# EAGLE board CFT-PB1-revC-TSSOP (EAGLE 5.11), part 1 of 2
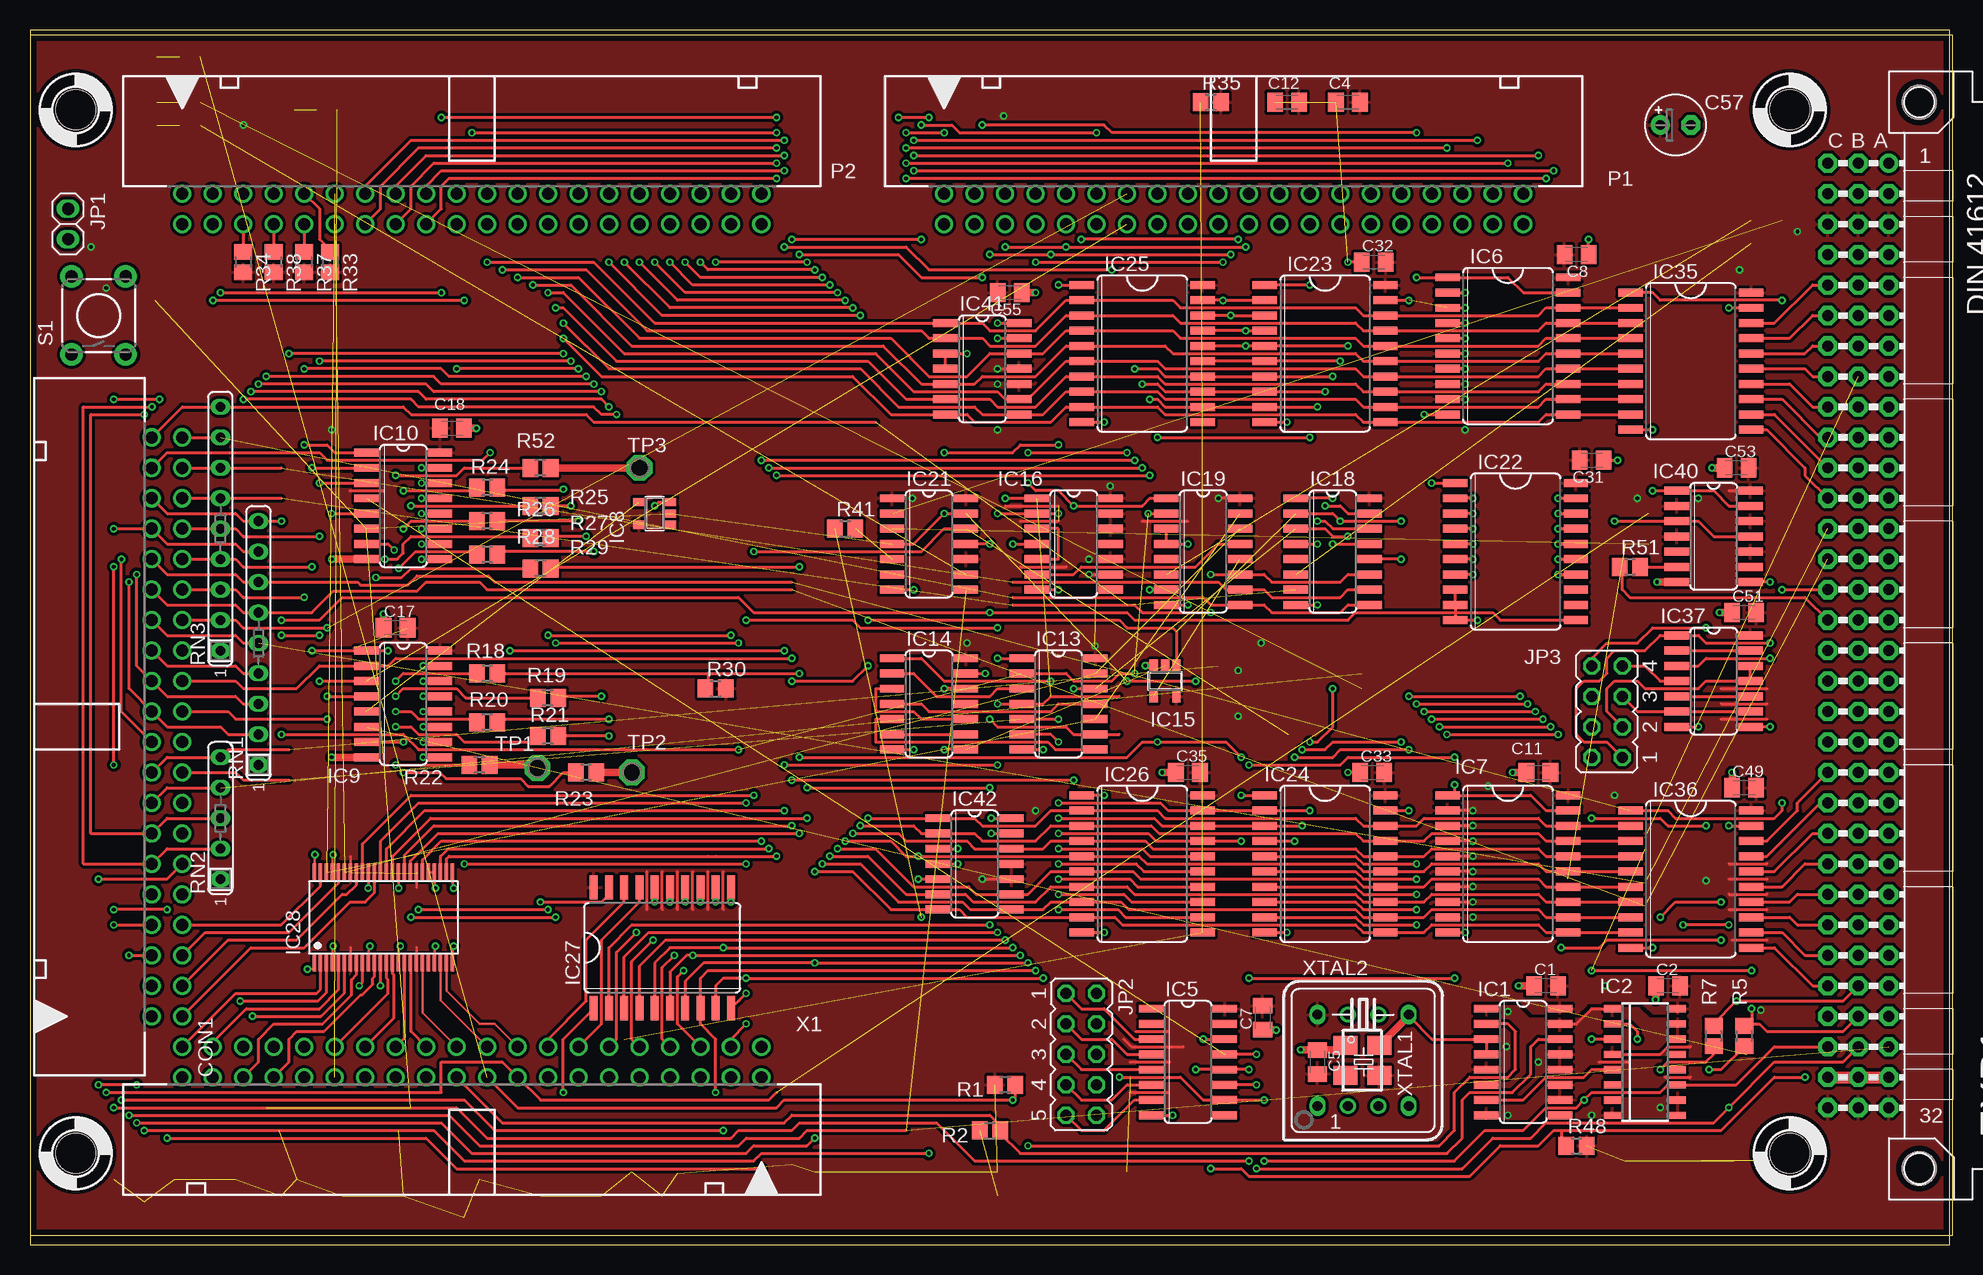
[diagram p11: board, top side]
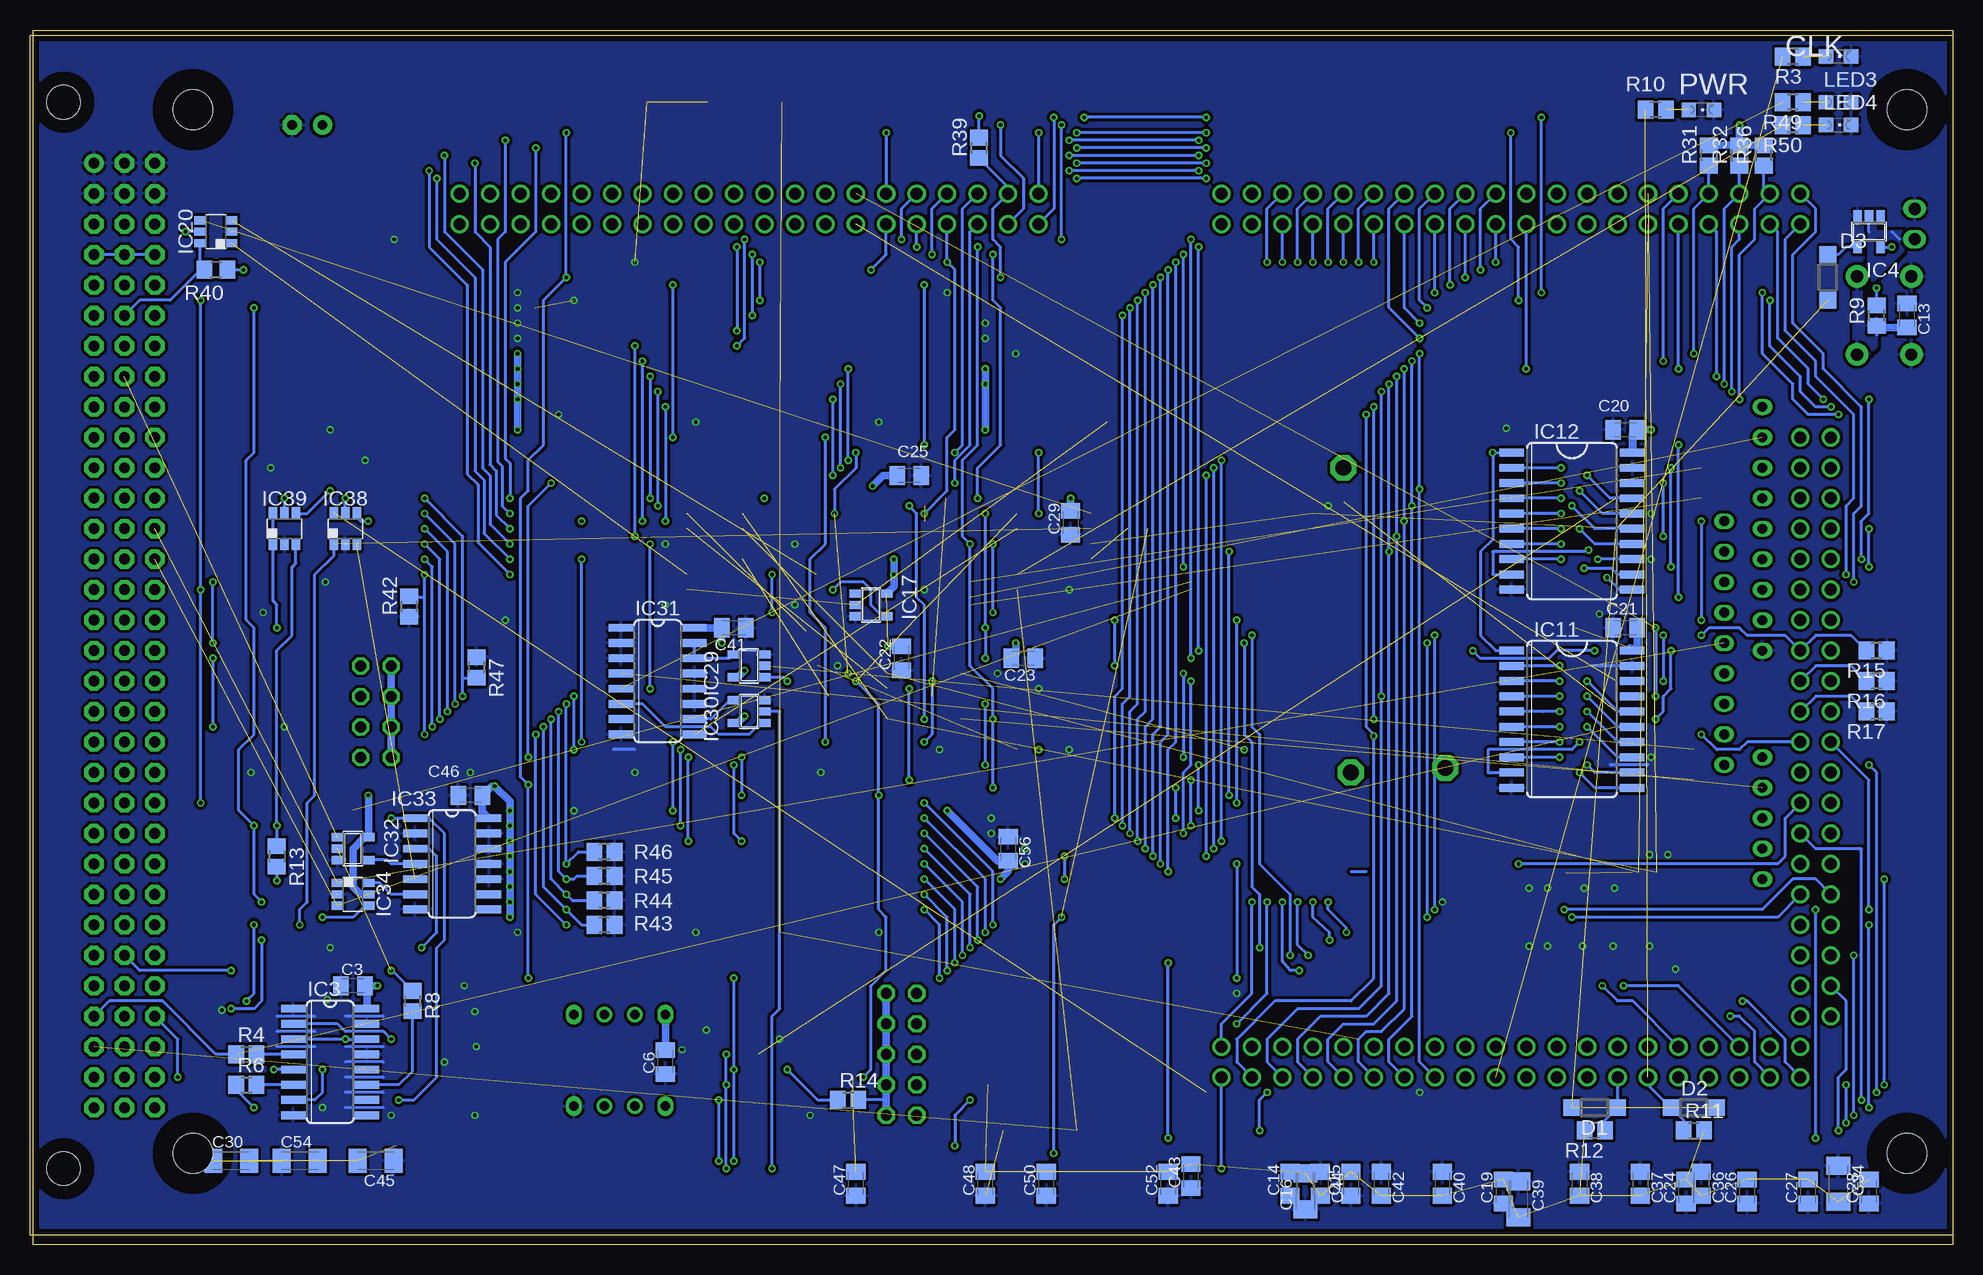
[diagram p12: board, bottom side, seen from below]

Size 160 x 101.27 mm. Coordinates in mm from the lower left corner, seen from the top.
Outline: 0,0 160,0 160,101.27 0,101.27 0,0
Copper layers (1*16): Top 0.035mm / dielectric 1.5mm / Bottom 0.035mm
Design rules "smart-prototyping *": minimum track width 7mil, minimum drill 12mil, track to track 7mil, track to pad 7mil, pad to pad 7mil, via to via 7mil, smd to smd 0mil, copper to edge 20mil, drill to drill 10mil, minimum pad ring 10mil, minimum via ring 6mil, stop-mask expansion 2mil, vias tented up to drill 25mil, thermal gap 10mil
Net classes: 0 default: width 0.152 mm, clearance 0.152 mm; 1 low power: width 0.305 mm, clearance 0.152 mm; 2 LED power: width 0.406 mm, clearance 0.254 mm

## Footprints (pad centres in the part's own frame; a part is rotated, then mirrored left to right if it is on the bottom)
C0805K = smd 1.3 x 1.6: 1 -1,0; 2 1,0
C1206K = smd 1.5 x 2: 1 -1.5,0; 2 1.5,0
E2,5-5 = drill 0.813 pad 1.6 round: + -1.27,0 | drill 0.813 pad 1.6 octagon: - 1.27,0
PAK100/2500-5-40 = drill 1 pad 1.422 round: 1 -24.13,-1.27; 2 -24.13,1.27; 3 -21.59,-1.27; 4 -21.59,1.27; 5 -19.05,-1.27; 6 -19.05,1.27; 7 -16.51,-1.27; 8 -16.51,1.27; 9 -13.97,-1.27; 10 -13.97,1.27; 11 -11.43,-1.27; 12 -11.43,1.27; 13 -8.89,-1.27; 14 -8.89,1.27; 15 -6.35,-1.27; 16 -6.35,1.27; 17 -3.81,-1.27; 18 -3.81,1.27; 19 -1.27,-1.27; 20 -1.27,1.27; 21 1.27,-1.27; 22 1.27,1.27; 23 3.81,-1.27; 24 3.81,1.27; 25 6.35,-1.27; 26 6.35,1.27; 27 8.89,-1.27; 28 8.89,1.27; 29 11.43,-1.27; 30 11.43,1.27; 31 13.97,-1.27; 32 13.97,1.27; 33 16.51,-1.27; 34 16.51,1.27; 35 19.05,-1.27; 36 19.05,1.27; 37 21.59,-1.27; 38 21.59,1.27; 39 24.13,-1.27; 40 24.13,1.27
SOD123 = smd 1.4 x 1.4: A 1.9,0; C -1.9,0
VG96K = drill 0.914 pad 1.6 round: A1 154.94,39.37 | drill 0.914 pad 1.6 octagon: A2 154.94,36.83; A3 154.94,34.29; A4 154.94,31.75; A5 154.94,29.21; A6 154.94,26.67; A7 154.94,24.13; A8 154.94,21.59; A9 154.94,19.05; A10 154.94,16.51; A11 154.94,13.97; A12 154.94,11.43; A13 154.94,8.89; A14 154.94,6.35; A15 154.94,3.81; A16 154.94,1.27; A17 154.94,-1.27; A18 154.94,-3.81; A19 154.94,-6.35; A20 154.94,-8.89; A21 154.94,-11.43; A22 154.94,-13.97; A23 154.94,-16.51; A24 154.94,-19.05; A25 154.94,-21.59; A26 154.94,-24.13; A27 154.94,-26.67; A28 154.94,-29.21; A29 154.94,-31.75; A30 154.94,-34.29; A31 154.94,-36.83; A32 154.94,-39.37; B1 152.4,39.37; B2 152.4,36.83; B3 152.4,34.29; B4 152.4,31.75; B5 152.4,29.21; B6 152.4,26.67; B7 152.4,24.13; B8 152.4,21.59; B9 152.4,19.05; B10 152.4,16.51; B11 152.4,13.97; B12 152.4,11.43; B13 152.4,8.89; B14 152.4,6.35; B15 152.4,3.81; B16 152.4,1.27; B17 152.4,-1.27; B18 152.4,-3.81; B19 152.4,-6.35; B20 152.4,-8.89; B21 152.4,-11.43; B22 152.4,-13.97; B23 152.4,-16.51; B24 152.4,-19.05; B25 152.4,-21.59; B26 152.4,-24.13; B27 152.4,-26.67; B28 152.4,-29.21; B29 152.4,-31.75; B30 152.4,-34.29; B31 152.4,-36.83; B32 152.4,-39.37; C1 149.86,39.37; C2 149.86,36.83; C3 149.86,34.29; C4 149.86,31.75; C5 149.86,29.21; C6 149.86,26.67; C7 149.86,24.13; C8 149.86,21.59; C9 149.86,19.05; C10 149.86,16.51; C11 149.86,13.97; C12 149.86,11.43; C13 149.86,8.89; C14 149.86,6.35; C15 149.86,3.81; C16 149.86,1.27; C17 149.86,-1.27; C18 149.86,-3.81; C19 149.86,-6.35; C20 149.86,-8.89; C21 149.86,-11.43; C22 149.86,-13.97; C23 149.86,-16.51; C24 149.86,-19.05; C25 149.86,-21.59; C26 149.86,-24.13; C27 149.86,-26.67; C28 149.86,-29.21; C29 149.86,-31.75; C30 149.86,-34.29; C31 149.86,-36.83; C32 149.86,-39.37 | hole 2.794: 157.48,44.45; 157.48,-44.45
SO16 = smd 0.66 x 2.032: 1 -4.445,-3.073; 2 -3.175,-3.073; 3 -1.905,-3.073; 4 -0.635,-3.073; 5 0.635,-3.073; 6 1.905,-3.073; 7 3.175,-3.073; 8 4.445,-3.073; 9 4.445,3.073; 10 3.175,3.073; 11 1.905,3.073; 12 0.635,3.073; 13 -0.635,3.073; 14 -1.905,3.073; 15 -3.175,3.073; 16 -4.445,3.073
SO16D = smd 0.6 x 1.4: 1 -4.445,-2.715; 2 -3.175,-2.715; 3 -1.905,-2.715; 4 -0.635,-2.715; 5 0.635,-2.715; 6 1.905,-2.715; 7 3.175,-2.715; 8 4.445,-2.715; 9 4.445,2.715; 10 3.175,2.715; 11 1.905,2.715; 12 0.635,2.715; 13 -0.635,2.715; 14 -1.905,2.715; 15 -3.175,2.715; 16 -4.445,2.715
SOT23-5 = smd 0.69 x 0.99: 1 -0.95,-1.29; 2 0,-1.29; 3 0.95,-1.29; 4 0.95,1.3; 5 -0.95,1.3
SO20W = smd 0.66 x 2.032: 1 -5.715,-5.029; 2 -4.445,-5.029; 3 -3.175,-5.029; 4 -1.905,-5.029; 5 -0.635,-5.029; 6 0.635,-5.029; 7 1.905,-5.029; 8 3.175,-5.029; 9 4.445,-5.029; 10 5.715,-5.029; 11 5.715,5.029; 12 4.445,5.029; 13 3.175,5.029; 14 1.905,5.029; 15 0.635,5.029; 16 -0.635,5.029; 17 -1.905,5.029; 18 -3.175,5.029; 19 -4.445,5.029; 20 -5.715,5.029
SO14 = smd 0.66 x 2.032: 1 -3.81,-3.073; 2 -2.54,-3.073; 3 -1.27,-3.073; 4 0,-3.073; 5 1.27,-3.073; 6 2.54,-3.073; 7 3.81,-3.073; 8 3.81,3.073; 9 2.54,3.073; 10 1.27,3.073; 11 0,3.073; 12 -1.27,3.073; 13 -2.54,3.073; 14 -3.81,3.073
DBV_R-PDSO-G6 = smd 0.69 x 0.99: 1 -0.95,-1.29; 2 0,-1.29; 3 0.95,-1.29; 4 0.95,1.3; 5 0,1.3; 6 -0.95,1.3
TSSOP-48 = smd 0.28 x 1.43: 1 -5.49,-3.794; 2 -4.99,-3.794; 3 -4.49,-3.794; 4 -3.99,-3.794; 5 -3.49,-3.794; 6 -2.99,-3.794; 7 -2.49,-3.794; 8 -1.99,-3.794; 9 -1.49,-3.794; 10 -0.99,-3.794; 11 -0.49,-3.794; 12 0.01,-3.794; 13 0.51,-3.794; 14 1.01,-3.794; 15 1.51,-3.794; 16 2.01,-3.794; 17 2.51,-3.794; 18 3.01,-3.794; 19 3.51,-3.794; 20 4.01,-3.794; 21 4.51,-3.794; 22 5.01,-3.794; 23 5.51,-3.794; 24 6.01,-3.794; 25 6.01,3.756; 26 5.51,3.756; 27 5.01,3.756; 28 4.51,3.756; 29 4.01,3.756; 30 3.51,3.756; 31 3.01,3.756; 32 2.51,3.756; 33 2.01,3.756; 34 1.51,3.756; 35 1.01,3.756; 36 0.51,3.756; 37 0.01,3.756; 38 -0.49,3.756; 39 -0.99,3.756; 40 -1.49,3.756; 41 -1.99,3.756; 42 -2.49,3.756; 43 -2.99,3.756; 44 -3.49,3.756; 45 -3.99,3.756; 46 -4.49,3.756; 47 -4.99,3.756; 48 -5.49,3.756
1X02 = drill 1.016 long: 1 -1.27,0; 2 1.27,0
JP5Q = drill 0.914 octagon: 1 -5.08,-1.27; 2 -5.08,1.27; 3 -2.54,-1.27; 4 -2.54,1.27; 5 0,-1.27; 6 0,1.27; 7 2.54,-1.27; 8 2.54,1.27; 9 5.08,-1.27; 10 5.08,1.27
JP4Q = drill 0.914 octagon: 1 -3.81,-1.27; 2 -3.81,1.27; 3 -1.27,-1.27; 4 -1.27,1.27; 5 1.27,-1.27; 6 1.27,1.27; 7 3.81,-1.27; 8 3.81,1.27
CHIPLED_0805 = smd 1.2 x 1.2: A 0,-1.05; C 0,1.05
R0805 = smd 1.3 x 1.5: 1 -0.85,0; 2 0.85,0
R0805' = smd 1.3 x 1.5: 1 -0.95,0; 2 0.95,0
SIL9 = drill 0.813 long: 1 -10.16,0; 2 -7.62,0; 3 -5.08,0; 4 -2.54,0; 5 0,0; 6 2.54,0; 7 5.08,0; 8 7.62,0; 9 10.16,0
SIL5 = drill 0.813 long: 1 -5.08,0; 2 -2.54,0; 3 0,0; 4 2.54,0; 5 5.08,0
TACTILE-PTH = drill 1.016 pad 1.88 round: 1 -3.251,2.261; 2 3.251,2.261; 3 -3.251,-2.261; 4 3.251,-2.261
P1-13 = drill 1.321 pad 2.159 octagon: TP 0,0
STANDOFF_28_60 = hole 3.302: 0,0
CRYSTAL-SMD-5X3.2MM = smd 1.6 x 2: 1 1.125,-1.475; 2 -1.375,-1.475; 3 -1.375,1.35; 4 1.125,1.35
DIL08S-SOCKET = drill 0.813 long: 1 -3.81,-3.81; 4 3.81,-3.81; 5 3.81,3.81; 8 -3.81,3.81 | drill 0.8 round: 2 -1.27,-3.81; 3 1.27,-3.81; 6 1.27,3.81; 7 -1.27,3.81

## Placement (x,y rotation side)
$4_37_$  SIGNATURESILK  [SIGNATURE]  30.48,-15.88 0 top  (outside the outline)
$4_39_$  OSHW-LOGOL  [OSHW-LOGO-L]  44.45,-10.79 0 top  (outside the outline)
$4_39_$1  OSHW-LOGOL  [OSHW-LOGO-L]  53.34,-10.79 0 top  (outside the outline)
$4_40_$  QRCODE-CFT  [CFT-QRCODE]  3.81,-24.77 0 top  (outside the outline)
C1  0.1uF  [C0805K]  126.36,21.59 0 top
C2  0.1uF  [C0805K]  136.53,21.59 0 top
C3  0.1uF  [C0805K]  133.35,21.59 0 bottom
C4  1uF  [C0805K]  109.86,95.25 0 top
C5  0.1uF  [C0805K]  107.31,15.24 270 top
C6  0.1uF  [C0805K]  107.31,15.24 90 bottom
C7  0.1uF  [C0805K]  102.74,18.92 90 top
C8  0.1uF  [C0805K]  128.91,82.55 180 top
C11  0.1uF  [C0805K]  125.73,39.37 0 top
C12  1uF  [C0805K]  104.78,95.25 0 top
C13  0.1uF  [C0805K]  3.81,77.47 270 bottom
C14  0.1uF  [C0805K]  55.24,5.08 90 bottom
C15  0.1uF  [C0805K]  50.16,5.08 90 bottom
C16  1uF  [C1206K]  53.98,4.45 90 bottom
C17  0.1uF  [C0805K]  30.48,51.44 0 top
C18  0.1uF  [C0805K]  35.18,68.07 180 top
C19  0.1uF  [C0805K]  37.47,4.45 90 bottom
C20  0.1uF  [C0805K]  27.3,67.94 0 bottom
C21  1uF  [C0805K]  27.3,51.44 0 bottom
C22  0.1uF  [C0805K]  87.63,48.9 90 bottom
C23  0.1uF  [C0805K]  77.47,48.9 180 bottom
C24  0.1uF  [C0805K]  22.23,4.45 90 bottom
C25  0.1uF  [C0805K]  87,64.14 180 bottom
C26  0.1uF  [C0805K]  17.14,4.45 90 bottom
C27  0.1uF  [C0805K]  12.06,4.45 90 bottom
C28  0.1uF  [C0805K]  6.99,4.45 90 bottom
C29  0.1uF  [C0805K]  73.53,60.2 90 bottom
C30  1uF  [C1206K]  143.51,6.98 0 bottom
C31  0.1uF  [C0805K]  130.18,65.41 180 top
C32  0.1uF  [C0805K]  112.01,81.91 0 top
C33  0.1uF  [C0805K]  111.89,39.37 0 top
C34  1uF  [C1206K]  9.53,5.08 270 bottom
C35  0.1uF  [C0805K]  96.52,39.37 0 top
C36  0.1uF  [C0805K]  20.95,5.08 270 bottom
C37  0.1uF  [C0805K]  26.04,5.08 270 bottom
C38  0.1uF  [C0805K]  31.11,5.08 270 bottom
C39  1uF  [C1206K]  36.2,3.81 270 bottom
C40  0.1uF  [C0805K]  42.55,5.08 270 bottom
C41  0.1uF  [C0805K]  101.6,51.44 180 bottom
C42  0.1uF  [C0805K]  47.62,5.08 270 bottom
C43  0.1uF  [C0805K]  63.5,5.71 90 bottom
C44  0.1uF  [C0805K]  52.7,5.08 270 bottom
C45  1uF  [C1206K]  131.44,6.98 180 bottom
C46  0.1uF  [C0805K]  123.57,37.47 0 bottom
C47  0.1uF  [C0805K]  91.44,5.08 90 bottom
C48  0.1uF  [C0805K]  80.64,5.08 90 bottom
C49  0.1uF  [C0805K]  142.88,38.1 0 top
C50  0.1uF  [C0805K]  75.56,5.08 90 bottom
C51  0.1uF  [C0805K]  142.88,52.71 0 top
C52  0.1uF  [C0805K]  65.41,5.08 90 bottom
C53  0.1uF  [C0805K]  142.24,64.77 0 top
C54  1uF  [C1206K]  137.79,6.98 0 bottom
C55  0.1uF  [C0805K]  81.66,79.38 180 top
C56  0.1uF  [C0805K]  78.74,33.02 270 bottom
C57  1uF  [E2,5-5]  137.16,93.34 0 top
CON1  2540-5  [PAK100/2500-5-40]  11.43,43.18 90 top
D1  [SOD123]  29.84,11.43 180 bottom
D2  [SOD123]  21.59,11.43 0 bottom
D3  [SOD123]  10.41,80.64 270 bottom
EXP1  [VG96K]  0,50.8 0 top
IC1  74HC253D  [SO16]  124.46,15.24 270 top
IC2  74HC193D  [SO16D]  134.62,15.24 270 top
IC3  74HC139D  [SO16]  135.25,15.24 270 bottom
IC4  74AHC1G14DBV  [SOT23-5]  6.99,84.45 180 bottom
IC5  74HC590D  [SO16]  96.52,15.24 270 top
IC6  74HC541DW  [SO20W]  123.19,74.93 270 top
IC7  74HC541DW  [SO20W]  123.19,31.75 270 top
IC8  74AHC1G04DBV  [SOT23-5]  52.07,60.96 90 top
IC9  74HC138D  [SO16]  31.11,45.09 270 top
IC10  74HC138D  [SO16]  31.11,61.6 270 top
IC11  74HC541DW  [SO20W]  31.75,43.82 270 bottom
IC12  74HC541DW  [SO20W]  31.75,60.33 270 bottom
IC13  74HC08D  [SO14]  85.72,45.09 270 top
IC14  74HC32D  [SO14]  74.93,45.09 270 top
IC15  74AHC1G86DBV  [SOT23-5]  94.61,46.99 180 top
IC16  74HC32D  [SO14]  87,58.42 270 top
IC17  74AHC1G04DBV  [SOT23-5]  90.17,53.34 270 bottom
IC18  74HC251D  [SO16]  108.58,57.79 270 top
IC19  74HC251D  [SO16]  97.79,57.79 270 top
IC20  74LVC1G11DBV  [DBV_R-PDSO-G6]  144.78,84.45 90 bottom
IC21  74HC74D  [SO14]  74.93,58.42 270 top
IC22  74HC574D  [SO20W]  123.83,57.79 270 top
IC23  74HC541DW  [SO20W]  107.95,74.3 270 top
IC24  74HC541DW  [SO20W]  107.95,31.75 270 top
IC25  74HC573D  [SO20W]  92.71,74.3 270 top
IC26  74HC573D  [SO20W]  92.71,31.75 270 top
IC27  74HC541DW  [SO20W]  52.7,24.77 0 top
IC28  74AC16244DGG  [TSSOP-48]  29.21,27.3 0 top
IC29  74AHC1G08DBV  [SOT23-5]  100.33,48.26 90 bottom
IC30  74AHC1G32DBV  [SOT23-5]  100.33,44.45 90 bottom
IC31  74HC112D  [SO16]  107.95,46.99 270 bottom
IC32  74AHC1G32DBV  [SOT23-5]  133.35,33.02 270 bottom
IC33  74HC74D  [SO14]  125.09,31.75 270 bottom
IC34  74AC1G11DBV  [DBV_R-PDSO-G6]  133.35,29.21 270 bottom
IC35  74HC245DW  [SO20W]  138.43,73.66 270 top
IC36  74HC245DW  [SO20W]  138.43,30.48 270 top
IC37  74AC04D  [SO14]  140.34,46.99 270 top
IC38  74AC1G27DBV  [DBV_R-PDSO-G6]  133.99,59.69 0 bottom
IC39  74AC1G11DBV  [DBV_R-PDSO-G6]  139.06,59.69 0 bottom
IC40  74HC74D  [SO14]  140.34,59.05 270 top
IC41  SN74ACT1071D  [SO14]  79.38,73.02 270 top
IC42  SN74ACT1071D  [SO14]  78.74,31.75 270 top
JP1  [1X02]  3.17,85.09 270 top
JP2  [JP5Q]  87.63,15.88 270 top
JP3  [JP4Q]  131.44,44.45 90 top
LED1  LED-5MM-GREEN  [CHIPLED_0805]  9.53,99.06 270 bottom
LED2  LED-5MM-GREEN  [CHIPLED_0805]  20.95,94.61 270 bottom
LED3  LED-5MM-GREEN  [CHIPLED_0805]  9.53,95.25 270 bottom
LED4  LED-5MM-GREEN  [CHIPLED_0805]  9.53,93.34 270 bottom
P1  2540-5  [PAK100/2500-5-40]  100.33,86.36 0 top
P2  2540-5  [PAK100/2500-5-40]  36.83,86.36 0 top
R1  4k7  [R0805]  81.28,13.33 180 top
R2  4k7  [R0805]  80.01,9.53 0 top
R3  330R  [R0805]  13.34,99.06 180 bottom
R4  30R  [R0805]  142.24,15.88 0 bottom
R5  30R  [R0805]  142.88,17.4 270 top
R6  30R  [R0805]  142.24,13.33 0 bottom
R7  30R  [R0805]  140.34,17.4 270 top
R8  30R  [R0805]  128.4,20.32 270 bottom
R9  50k  [R0805]  6.35,77.47 90 bottom
R10  330R  [R0805]  24.77,94.61 180 bottom
R11  4k7  [R0805]  21.59,9.53 0 bottom
R12  4k7  [R0805]  29.84,9.53 180 bottom
R13  4k7  [R0805]  139.7,32.38 270 bottom
R14  30R  [R0805]  92.08,12.06 0 bottom
R15  4k7  [R0805]  6.35,49.53 180 bottom
R16  4k7  [R0805]  6.35,46.99 180 bottom
R17  4k7  [R0805]  6.35,44.45 180 bottom
R18  30R  [R0805]  38.1,47.62 180 top
R19  30R  [R0805]  43.18,45.59 180 top
R20  30R  [R0805]  38.1,43.56 180 top
R21  30R  [R0805]  43.18,42.42 180 top
R22  30R  [R0805]  37.47,40.01 180 top
R23  30R  [R0805]  46.35,39.37 180 top
R24  30R  [R0805]  38.1,63.12 180 top
R25  30R  [R0805]  42.55,61.6 180 top
R26  30R  [R0805]  38.1,60.33 180 top
R27  30R  [R0805]  42.55,58.93 180 top
R28  30R  [R0805]  38.1,57.53 180 top
R29  30R  [R0805]  42.55,56.39 180 top
R30  4k7  [R0805]  57.15,46.36 0 top
R31  4k7  [R0805]  20.32,90.8 90 bottom
R32  4k7  [R0805]  17.78,90.8 90 bottom
R33  4k7  [R0805]  25.02,81.91 270 top
R34  4k7  [R0805]  17.78,81.91 270 top
R35  4k7  [R0805]  98.42,95.25 0 top
R36  4k7  [R0805]  15.75,90.8 90 bottom
R37  4k7  [R0805]  22.86,81.91 270 top
R38  4k7  [R0805]  20.32,81.91 270 top
R39  4k7  [R0805]  81.15,91.44 90 bottom
R40  4k7  [R0805']  144.78,81.28 180 bottom
R41  30R  [R0805]  67.94,59.69 0 top
R42  4k7  [R0805]  128.65,53.21 90 bottom
R43  4k7  [R0805]  112.39,26.67 180 bottom
R44  4k7  [R0805]  112.39,28.7 180 bottom
R45  4k7  [R0805]  112.39,30.73 180 bottom
R46  4k7  [R0805]  112.39,32.77 180 bottom
R47  4k7  [R0805]  123.06,48.13 270 bottom
R48  4k7  [R0805]  128.91,8.26 0 top
R49  330R  [R0805]  13.34,95.25 180 bottom
R50  330R  [R0805]  13.34,93.34 180 bottom
R51  30R  [R0805]  133.35,56.52 0 top
R52  30R  [R0805]  42.55,64.77 180 top
RN1  [SIL9]  19.05,50.17 90 top
RN2  [SIL5]  15.88,35.56 90 top
RN3  [SIL9]  15.88,59.69 90 top
S1  [TACTILE-PTH]  5.71,77.47 90 top
TP1  TPPAD1-13  [P1-13]  42.29,39.75 0 top
TP2  TPPAD1-13  [P1-13]  50.16,39.37 0 top
TP3  TPPAD1-13  [P1-13]  50.8,64.77 0 top
U1  HOLE  [STANDOFF_28_60]  3.81,94.61 0 top
U2  HOLE  [STANDOFF_28_60]  3.81,7.62 0 top
U3  HOLE  [STANDOFF_28_60]  146.69,94.61 0 top
U4  HOLE  [STANDOFF_28_60]  146.69,7.62 0 top
X1  2540-5  [PAK100/2500-5-40]  36.83,15.24 180 top
XTAL1  16.000MHz  [CRYSTAL-SMD-5X3.2MM]  111.12,15.24 270 top
XTAL2  16.000MHz  [DIL08S-SOCKET]  111.12,15.37 0 top